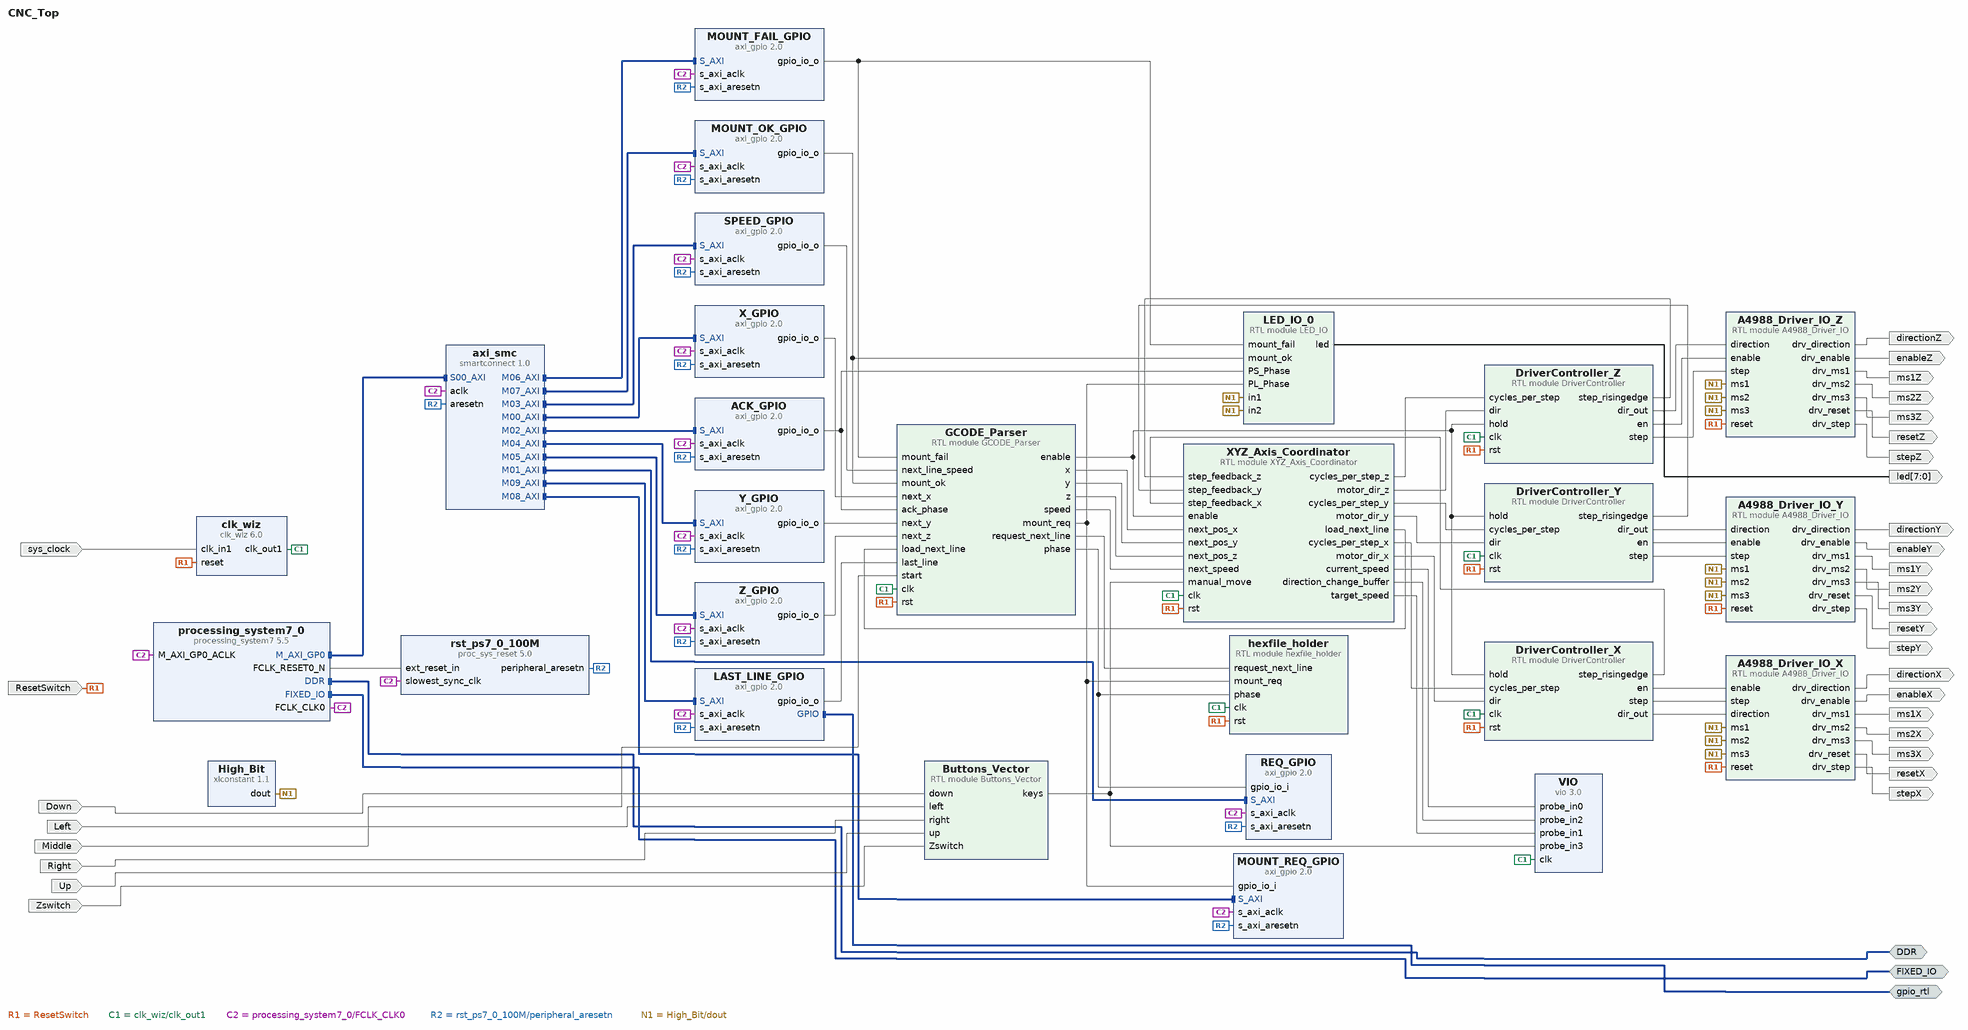
[diagram p0: block diagram of the top level]
# Vivado block design CNC_Top, xc7z020clg484-1, Vivado 2024.2
create_bd_design CNC_Top

create_bd_intf_port -mode Master -vlnv xilinx.com:interface:ddrx_rtl:1.0 DDR
create_bd_intf_port -mode Master -vlnv xilinx.com:display_processing_system7:fixedio_rtl:1.0 FIXED_IO
create_bd_intf_port -mode Master -vlnv xilinx.com:interface:gpio_rtl:1.0 gpio_rtl
create_bd_port -dir I -type clk sys_clock
set_property -dict {CONFIG.FREQ_HZ 100000000 CONFIG.PHASE 0.0} [get_bd_ports sys_clock]
create_bd_port -dir O directionX
create_bd_port -dir O stepX
create_bd_port -dir O -type rst resetX
create_bd_port -dir O ms1X
create_bd_port -dir O ms2X
create_bd_port -dir O ms3X
create_bd_port -dir O enableX
create_bd_port -dir O -from 7 -to 0 led
create_bd_port -dir O enableZ
create_bd_port -dir O directionZ
create_bd_port -dir O stepZ
create_bd_port -dir O resetZ
create_bd_port -dir O ms1Z
create_bd_port -dir O ms2Z
create_bd_port -dir O ms3Z
create_bd_port -dir O enableY
create_bd_port -dir O directionY
create_bd_port -dir O stepY
create_bd_port -dir O resetY
create_bd_port -dir O ms1Y
create_bd_port -dir O ms2Y
create_bd_port -dir O ms3Y
create_bd_port -dir I ResetSwitch
create_bd_port -dir I Middle
create_bd_port -dir I Left
create_bd_port -dir I Right
create_bd_port -dir I Up
create_bd_port -dir I Down
create_bd_port -dir I Zswitch

create_bd_cell -type ip -vlnv xilinx.com:ip:clk_wiz:6.0 clk_wiz
set_property -dict [list \
  CONFIG.CLKOUT1_REQUESTED_OUT_FREQ 100.0 \
  CONFIG.CLK_IN1_BOARD_INTERFACE sys_clock \
  CONFIG.USE_BOARD_FLOW true \
  CONFIG.USE_LOCKED false \
] [get_bd_cells clk_wiz]
create_bd_cell -type ip -vlnv xilinx.com:ip:xlconstant:1.1 High_Bit
set_property -dict {CONFIG.CONST_VAL 1 CONFIG.CONST_WIDTH 1} [get_bd_cells High_Bit]
create_bd_cell -type module -reference A4988_Driver_IO A4988_Driver_IO_X
create_bd_cell -type module -reference DriverController DriverController_X
create_bd_cell -type module -reference LED_IO LED_IO_0
create_bd_cell -type module -reference XYZ_Axis_Coordinator XYZ_Axis_Coordinator
create_bd_cell -type module -reference GCODE_Parser GCODE_Parser
create_bd_cell -type module -reference DriverController DriverController_Y
create_bd_cell -type module -reference DriverController DriverController_Z
create_bd_cell -type module -reference A4988_Driver_IO A4988_Driver_IO_Y
create_bd_cell -type module -reference A4988_Driver_IO A4988_Driver_IO_Z
create_bd_cell -type ip -vlnv xilinx.com:ip:vio:3.0 VIO
set_property -dict [list \
  CONFIG.C_NUM_PROBE_IN 4 \
  CONFIG.C_NUM_PROBE_OUT 0 \
  CONFIG.C_PROBE_IN0_WIDTH 8 \
  CONFIG.C_PROBE_IN1_WIDTH 8 \
  CONFIG.C_PROBE_IN2_WIDTH 32 \
  CONFIG.C_PROBE_IN3_WIDTH 5 \
] [get_bd_cells VIO]
create_bd_cell -type module -reference Buttons_Vector Buttons_Vector
create_bd_cell -type module -reference hexfile_holder hexfile_holder
create_bd_cell -type ip -vlnv xilinx.com:ip:processing_system7:5.5 processing_system7_0
set_property -dict [list \
  CONFIG.PCW_APU_PERIPHERAL_FREQMHZ 666.666667 \
  CONFIG.PCW_ENET0_PERIPHERAL_ENABLE 0 \
  CONFIG.PCW_FPGA0_PERIPHERAL_FREQMHZ 100.000000 \
  CONFIG.PCW_FPGA1_PERIPHERAL_FREQMHZ 150.000000 \
  CONFIG.PCW_FPGA2_PERIPHERAL_FREQMHZ 50.000000 \
  CONFIG.PCW_GPIO_MIO_GPIO_ENABLE 0 \
  CONFIG.PCW_PERIPHERAL_BOARD_PRESET part0 \
  CONFIG.PCW_PRESET_BANK1_VOLTAGE {LVCMOS 1.8V} \
  CONFIG.PCW_QSPI_PERIPHERAL_ENABLE 0 \
  CONFIG.PCW_SD0_GRP_CD_ENABLE 1 \
  CONFIG.PCW_SD0_GRP_CD_IO {MIO 47} \
  CONFIG.PCW_SD0_GRP_WP_ENABLE 1 \
  CONFIG.PCW_SD0_GRP_WP_IO {MIO 46} \
  CONFIG.PCW_SD0_PERIPHERAL_ENABLE 1 \
  CONFIG.PCW_SD0_SD0_IO {MIO 40 .. 45} \
  CONFIG.PCW_SDIO_PERIPHERAL_FREQMHZ 50 \
  CONFIG.PCW_UART1_PERIPHERAL_ENABLE 1 \
  CONFIG.PCW_UART1_UART1_IO {MIO 48 .. 49} \
  CONFIG.PCW_UART_PERIPHERAL_FREQMHZ 50 \
  CONFIG.PCW_UIPARAM_DDR_FREQ_MHZ 533.333313 \
  CONFIG.PCW_UIPARAM_DDR_PARTNO {MT41J128M16 HA-15E} \
  CONFIG.PCW_USB0_PERIPHERAL_ENABLE 0 \
  CONFIG.preset ZedBoard \
] [get_bd_cells processing_system7_0]
# 94 more settings of processing_system7_0 are not shown: defaults, MIO pin electricals, DDR timing, and values the tool derives
create_bd_cell -type ip -vlnv xilinx.com:ip:axi_gpio:2.0 X_GPIO
set_property -dict [list \
  CONFIG.C_ALL_INPUTS 0 \
  CONFIG.C_ALL_OUTPUTS 1 \
  CONFIG.C_GPIO_WIDTH 32 \
  CONFIG.GPIO_BOARD_INTERFACE Custom \
  CONFIG.USE_BOARD_FLOW true \
] [get_bd_cells X_GPIO]
create_bd_cell -type ip -vlnv xilinx.com:ip:smartconnect:1.0 axi_smc
set_property -dict {CONFIG.NUM_MI 10 CONFIG.NUM_SI 1} [get_bd_cells axi_smc]
create_bd_cell -type ip -vlnv xilinx.com:ip:proc_sys_reset:5.0 rst_ps7_0_100M
create_bd_cell -type ip -vlnv xilinx.com:ip:axi_gpio:2.0 Y_GPIO
set_property -dict [list \
  CONFIG.C_ALL_INPUTS 0 \
  CONFIG.C_ALL_OUTPUTS 1 \
  CONFIG.C_GPIO_WIDTH 32 \
  CONFIG.GPIO_BOARD_INTERFACE Custom \
  CONFIG.USE_BOARD_FLOW true \
] [get_bd_cells Y_GPIO]
create_bd_cell -type ip -vlnv xilinx.com:ip:axi_gpio:2.0 Z_GPIO
set_property -dict [list \
  CONFIG.C_ALL_INPUTS 0 \
  CONFIG.C_ALL_OUTPUTS 1 \
  CONFIG.C_GPIO_WIDTH 32 \
  CONFIG.GPIO_BOARD_INTERFACE Custom \
  CONFIG.USE_BOARD_FLOW true \
] [get_bd_cells Z_GPIO]
create_bd_cell -type ip -vlnv xilinx.com:ip:axi_gpio:2.0 SPEED_GPIO
set_property -dict [list \
  CONFIG.C_ALL_INPUTS 0 \
  CONFIG.C_ALL_OUTPUTS 1 \
  CONFIG.C_GPIO_WIDTH 8 \
  CONFIG.GPIO_BOARD_INTERFACE Custom \
  CONFIG.USE_BOARD_FLOW true \
] [get_bd_cells SPEED_GPIO]
create_bd_cell -type ip -vlnv xilinx.com:ip:axi_gpio:2.0 ACK_GPIO
set_property -dict [list \
  CONFIG.C_ALL_INPUTS 0 \
  CONFIG.C_ALL_OUTPUTS 1 \
  CONFIG.C_GPIO_WIDTH 2 \
  CONFIG.GPIO_BOARD_INTERFACE Custom \
  CONFIG.USE_BOARD_FLOW true \
] [get_bd_cells ACK_GPIO]
create_bd_cell -type ip -vlnv xilinx.com:ip:axi_gpio:2.0 REQ_GPIO
set_property -dict [list \
  CONFIG.C_ALL_INPUTS 1 \
  CONFIG.C_GPIO_WIDTH 2 \
  CONFIG.GPIO_BOARD_INTERFACE Custom \
  CONFIG.USE_BOARD_FLOW true \
] [get_bd_cells REQ_GPIO]
create_bd_cell -type ip -vlnv xilinx.com:ip:axi_gpio:2.0 MOUNT_OK_GPIO
set_property -dict [list \
  CONFIG.C_ALL_OUTPUTS 1 \
  CONFIG.C_GPIO_WIDTH 1 \
  CONFIG.GPIO_BOARD_INTERFACE Custom \
  CONFIG.USE_BOARD_FLOW true \
] [get_bd_cells MOUNT_OK_GPIO]
create_bd_cell -type ip -vlnv xilinx.com:ip:axi_gpio:2.0 MOUNT_FAIL_GPIO
set_property -dict [list \
  CONFIG.C_ALL_OUTPUTS 1 \
  CONFIG.C_GPIO_WIDTH 1 \
  CONFIG.GPIO_BOARD_INTERFACE Custom \
  CONFIG.USE_BOARD_FLOW true \
] [get_bd_cells MOUNT_FAIL_GPIO]
create_bd_cell -type ip -vlnv xilinx.com:ip:axi_gpio:2.0 MOUNT_REQ_GPIO
set_property -dict {CONFIG.C_ALL_INPUTS 1 CONFIG.C_GPIO_WIDTH 1} [get_bd_cells MOUNT_REQ_GPIO]
create_bd_cell -type ip -vlnv xilinx.com:ip:axi_gpio:2.0 LAST_LINE_GPIO
set_property -dict [list \
  CONFIG.C_ALL_OUTPUTS 1 \
  CONFIG.C_GPIO_WIDTH 1 \
  CONFIG.GPIO_BOARD_INTERFACE Custom \
  CONFIG.USE_BOARD_FLOW true \
] [get_bd_cells LAST_LINE_GPIO]

# ---- connections ----

connect_bd_intf_net [get_bd_intf_ports gpio_rtl] [get_bd_intf_pins LAST_LINE_GPIO/GPIO]
connect_bd_intf_net [get_bd_intf_pins axi_smc/M00_AXI] [get_bd_intf_pins X_GPIO/S_AXI]
connect_bd_intf_net [get_bd_intf_pins axi_smc/M01_AXI] [get_bd_intf_pins REQ_GPIO/S_AXI]
connect_bd_intf_net [get_bd_intf_pins axi_smc/M02_AXI] [get_bd_intf_pins ACK_GPIO/S_AXI]
connect_bd_intf_net [get_bd_intf_pins axi_smc/M03_AXI] [get_bd_intf_pins SPEED_GPIO/S_AXI]
connect_bd_intf_net [get_bd_intf_pins axi_smc/M04_AXI] [get_bd_intf_pins Y_GPIO/S_AXI]
connect_bd_intf_net [get_bd_intf_pins axi_smc/M05_AXI] [get_bd_intf_pins Z_GPIO/S_AXI]
connect_bd_intf_net [get_bd_intf_pins axi_smc/M06_AXI] [get_bd_intf_pins MOUNT_FAIL_GPIO/S_AXI]
connect_bd_intf_net [get_bd_intf_pins axi_smc/M07_AXI] [get_bd_intf_pins MOUNT_OK_GPIO/S_AXI]
connect_bd_intf_net [get_bd_intf_pins axi_smc/M08_AXI] [get_bd_intf_pins MOUNT_REQ_GPIO/S_AXI]
connect_bd_intf_net [get_bd_intf_pins axi_smc/M09_AXI] [get_bd_intf_pins LAST_LINE_GPIO/S_AXI]
connect_bd_intf_net [get_bd_intf_ports DDR] [get_bd_intf_pins processing_system7_0/DDR]
connect_bd_intf_net [get_bd_intf_ports FIXED_IO] [get_bd_intf_pins processing_system7_0/FIXED_IO]
connect_bd_intf_net [get_bd_intf_pins processing_system7_0/M_AXI_GP0] [get_bd_intf_pins axi_smc/S00_AXI]
connect_bd_net -net A4988_Driver_IO1_drv_direction [get_bd_pins A4988_Driver_IO_Y/drv_direction] [get_bd_ports directionY]
connect_bd_net -net A4988_Driver_IO1_drv_enable [get_bd_pins A4988_Driver_IO_Y/drv_enable] [get_bd_ports enableY]
connect_bd_net -net A4988_Driver_IO1_drv_ms1 [get_bd_pins A4988_Driver_IO_Y/drv_ms1] [get_bd_ports ms1Y]
connect_bd_net -net A4988_Driver_IO1_drv_ms2 [get_bd_pins A4988_Driver_IO_Y/drv_ms2] [get_bd_ports ms2Y]
connect_bd_net -net A4988_Driver_IO1_drv_ms3 [get_bd_pins A4988_Driver_IO_Y/drv_ms3] [get_bd_ports ms3Y]
connect_bd_net -net A4988_Driver_IO1_drv_reset [get_bd_pins A4988_Driver_IO_Y/drv_reset] [get_bd_ports resetY]
connect_bd_net -net A4988_Driver_IO1_drv_step [get_bd_pins A4988_Driver_IO_Y/drv_step] [get_bd_ports stepY]
connect_bd_net -net A4988_Driver_IO2_drv_direction [get_bd_pins A4988_Driver_IO_Z/drv_direction] [get_bd_ports directionZ]
connect_bd_net -net A4988_Driver_IO2_drv_enable [get_bd_pins A4988_Driver_IO_Z/drv_enable] [get_bd_ports enableZ]
connect_bd_net -net A4988_Driver_IO2_drv_ms1 [get_bd_pins A4988_Driver_IO_Z/drv_ms1] [get_bd_ports ms1Z]
connect_bd_net -net A4988_Driver_IO2_drv_ms2 [get_bd_pins A4988_Driver_IO_Z/drv_ms2] [get_bd_ports ms2Z]
connect_bd_net -net A4988_Driver_IO2_drv_ms3 [get_bd_pins A4988_Driver_IO_Z/drv_ms3] [get_bd_ports ms3Z]
connect_bd_net -net A4988_Driver_IO2_drv_reset [get_bd_pins A4988_Driver_IO_Z/drv_reset] [get_bd_ports resetZ]
connect_bd_net -net A4988_Driver_IO2_drv_step [get_bd_pins A4988_Driver_IO_Z/drv_step] [get_bd_ports stepZ]
connect_bd_net -net A4988_Driver_IO_drv_direction [get_bd_pins A4988_Driver_IO_X/drv_direction] [get_bd_ports directionX]
connect_bd_net -net A4988_Driver_IO_drv_enable [get_bd_pins A4988_Driver_IO_X/drv_enable] [get_bd_ports enableX]
connect_bd_net -net A4988_Driver_IO_drv_ms1 [get_bd_pins A4988_Driver_IO_X/drv_ms1] [get_bd_ports ms1X]
connect_bd_net -net A4988_Driver_IO_drv_ms2 [get_bd_pins A4988_Driver_IO_X/drv_ms2] [get_bd_ports ms2X]
connect_bd_net -net A4988_Driver_IO_drv_ms3 [get_bd_pins A4988_Driver_IO_X/drv_ms3] [get_bd_ports ms3X]
connect_bd_net -net A4988_Driver_IO_drv_reset [get_bd_pins A4988_Driver_IO_X/drv_reset] [get_bd_ports resetX]
connect_bd_net -net A4988_Driver_IO_drv_step [get_bd_pins A4988_Driver_IO_X/drv_step] [get_bd_ports stepX]
connect_bd_net [get_bd_pins ACK_GPIO/gpio_io_o] [get_bd_pins LED_IO_0/PS_Phase] [get_bd_pins GCODE_Parser/ack_phase]
connect_bd_net -net Buttons_Vector_0_keys [get_bd_pins Buttons_Vector/keys] [get_bd_pins VIO/probe_in3] [get_bd_pins XYZ_Axis_Coordinator/manual_move]
connect_bd_net [get_bd_ports Down] [get_bd_pins Buttons_Vector/down]
connect_bd_net -net DriverController_0_en [get_bd_pins DriverController_X/en] [get_bd_pins A4988_Driver_IO_X/enable]
connect_bd_net -net DriverController_0_step [get_bd_pins DriverController_X/step] [get_bd_pins A4988_Driver_IO_X/step]
connect_bd_net -net DriverController_X1_step_risingedge [get_bd_pins DriverController_Y/step_risingedge] \
  [get_bd_pins XYZ_Axis_Coordinator/step_feedback_y]
connect_bd_net -net DriverController_X2_step_risingedge [get_bd_pins DriverController_Z/step_risingedge] \
  [get_bd_pins XYZ_Axis_Coordinator/step_feedback_z]
connect_bd_net [get_bd_pins DriverController_X/dir_out] [get_bd_pins A4988_Driver_IO_X/direction]
connect_bd_net [get_bd_pins DriverController_X/step_risingedge] [get_bd_pins XYZ_Axis_Coordinator/step_feedback_x]
connect_bd_net [get_bd_pins DriverController_Y/dir_out] [get_bd_pins A4988_Driver_IO_Y/direction]
connect_bd_net [get_bd_pins DriverController_Y/en] [get_bd_pins A4988_Driver_IO_Y/enable]
connect_bd_net [get_bd_pins DriverController_Y/step] [get_bd_pins A4988_Driver_IO_Y/step]
connect_bd_net [get_bd_pins DriverController_Z/dir_out] [get_bd_pins A4988_Driver_IO_Z/direction]
connect_bd_net [get_bd_pins DriverController_Z/en] [get_bd_pins A4988_Driver_IO_Z/enable]
connect_bd_net [get_bd_pins DriverController_Z/step] [get_bd_pins A4988_Driver_IO_Z/step]
connect_bd_net -net GCODE_Parser_0_enable [get_bd_pins GCODE_Parser/enable] \
  [get_bd_pins DriverController_X/hold] [get_bd_pins DriverController_Y/hold] [get_bd_pins DriverController_Z/hold] \
  [get_bd_pins XYZ_Axis_Coordinator/enable]
connect_bd_net -net GCODE_Parser_0_mount_req [get_bd_pins GCODE_Parser/mount_req] \
  [get_bd_pins hexfile_holder/mount_req] [get_bd_pins LED_IO_0/PL_Phase] [get_bd_pins MOUNT_REQ_GPIO/gpio_io_i]
connect_bd_net -net GCODE_Parser_0_next_pos_x [get_bd_pins GCODE_Parser/x] [get_bd_pins XYZ_Axis_Coordinator/next_pos_x]
connect_bd_net -net GCODE_Parser_0_next_pos_y [get_bd_pins GCODE_Parser/y] [get_bd_pins XYZ_Axis_Coordinator/next_pos_y]
connect_bd_net -net GCODE_Parser_0_next_pos_z [get_bd_pins GCODE_Parser/z] [get_bd_pins XYZ_Axis_Coordinator/next_pos_z]
connect_bd_net -net GCODE_Parser_0_phase [get_bd_pins GCODE_Parser/phase] [get_bd_pins hexfile_holder/phase] [get_bd_pins REQ_GPIO/gpio_io_i]
connect_bd_net -net GCODE_Parser_0_request_next_line [get_bd_pins GCODE_Parser/request_next_line] [get_bd_pins hexfile_holder/request_next_line]
connect_bd_net -net GCODE_Parser_0_speed [get_bd_pins GCODE_Parser/speed] [get_bd_pins XYZ_Axis_Coordinator/next_speed]
connect_bd_net [get_bd_pins LAST_LINE_GPIO/gpio_io_o] [get_bd_pins GCODE_Parser/last_line]
connect_bd_net [get_bd_pins LED_IO_0/led] [get_bd_ports led]
connect_bd_net [get_bd_ports Left] [get_bd_pins Buttons_Vector/left]
connect_bd_net [get_bd_pins MOUNT_FAIL_GPIO/gpio_io_o] [get_bd_pins LED_IO_0/mount_fail] [get_bd_pins GCODE_Parser/mount_fail]
connect_bd_net [get_bd_pins MOUNT_OK_GPIO/gpio_io_o] [get_bd_pins LED_IO_0/mount_ok] [get_bd_pins GCODE_Parser/mount_ok]
connect_bd_net [get_bd_ports Middle] [get_bd_pins GCODE_Parser/start]
connect_bd_net [get_bd_ports ResetSwitch] \
  [get_bd_pins A4988_Driver_IO_X/reset] [get_bd_pins A4988_Driver_IO_Z/reset] [get_bd_pins A4988_Driver_IO_Y/reset] \
  [get_bd_pins hexfile_holder/rst] [get_bd_pins GCODE_Parser/rst] [get_bd_pins DriverController_X/rst] \
  [get_bd_pins DriverController_Y/rst] [get_bd_pins DriverController_Z/rst] [get_bd_pins clk_wiz/reset] \
  [get_bd_pins XYZ_Axis_Coordinator/rst]
connect_bd_net [get_bd_ports Right] [get_bd_pins Buttons_Vector/right]
connect_bd_net [get_bd_pins SPEED_GPIO/gpio_io_o] [get_bd_pins GCODE_Parser/next_line_speed]
connect_bd_net [get_bd_ports Up] [get_bd_pins Buttons_Vector/up]
connect_bd_net -net XYZ_Axis_Coordinator_0_current_speed [get_bd_pins XYZ_Axis_Coordinator/current_speed] [get_bd_pins VIO/probe_in0]
connect_bd_net -net XYZ_Axis_Coordinator_0_cycles_per_step_x [get_bd_pins XYZ_Axis_Coordinator/cycles_per_step_x] \
  [get_bd_pins DriverController_X/cycles_per_step]
connect_bd_net -net XYZ_Axis_Coordinator_0_cycles_per_step_y [get_bd_pins XYZ_Axis_Coordinator/cycles_per_step_y] \
  [get_bd_pins DriverController_Y/cycles_per_step]
connect_bd_net -net XYZ_Axis_Coordinator_0_cycles_per_step_z [get_bd_pins XYZ_Axis_Coordinator/cycles_per_step_z] \
  [get_bd_pins DriverController_Z/cycles_per_step]
connect_bd_net -net XYZ_Axis_Coordinator_0_dir_x [get_bd_pins XYZ_Axis_Coordinator/motor_dir_x] [get_bd_pins DriverController_X/dir]
connect_bd_net -net XYZ_Axis_Coordinator_0_dir_y [get_bd_pins XYZ_Axis_Coordinator/motor_dir_y] [get_bd_pins DriverController_Y/dir]
connect_bd_net -net XYZ_Axis_Coordinator_0_dir_z [get_bd_pins XYZ_Axis_Coordinator/motor_dir_z] [get_bd_pins DriverController_Z/dir]
connect_bd_net -net XYZ_Axis_Coordinator_0_direction_change_buffer [get_bd_pins XYZ_Axis_Coordinator/direction_change_buffer] \
  [get_bd_pins VIO/probe_in2]
connect_bd_net -net XYZ_Axis_Coordinator_0_load_next_line [get_bd_pins XYZ_Axis_Coordinator/load_next_line] [get_bd_pins GCODE_Parser/load_next_line]
connect_bd_net -net XYZ_Axis_Coordinator_0_target_speed [get_bd_pins XYZ_Axis_Coordinator/target_speed] [get_bd_pins VIO/probe_in1]
connect_bd_net [get_bd_pins X_GPIO/gpio_io_o] [get_bd_pins GCODE_Parser/next_x]
connect_bd_net [get_bd_pins Y_GPIO/gpio_io_o] [get_bd_pins GCODE_Parser/next_y]
connect_bd_net [get_bd_pins Z_GPIO/gpio_io_o] [get_bd_pins GCODE_Parser/next_z]
connect_bd_net [get_bd_ports Zswitch] [get_bd_pins Buttons_Vector/Zswitch]
connect_bd_net [get_bd_pins clk_wiz/clk_out1] \
  [get_bd_pins VIO/clk] [get_bd_pins hexfile_holder/clk] [get_bd_pins GCODE_Parser/clk] [get_bd_pins DriverController_X/clk] \
  [get_bd_pins DriverController_Y/clk] [get_bd_pins DriverController_Z/clk] [get_bd_pins XYZ_Axis_Coordinator/clk]
connect_bd_net [get_bd_pins processing_system7_0/FCLK_CLK0] \
  [get_bd_pins X_GPIO/s_axi_aclk] [get_bd_pins Y_GPIO/s_axi_aclk] [get_bd_pins Z_GPIO/s_axi_aclk] \
  [get_bd_pins SPEED_GPIO/s_axi_aclk] [get_bd_pins ACK_GPIO/s_axi_aclk] [get_bd_pins REQ_GPIO/s_axi_aclk] \
  [get_bd_pins MOUNT_OK_GPIO/s_axi_aclk] [get_bd_pins MOUNT_FAIL_GPIO/s_axi_aclk] [get_bd_pins MOUNT_REQ_GPIO/s_axi_aclk] \
  [get_bd_pins LAST_LINE_GPIO/s_axi_aclk] [get_bd_pins axi_smc/aclk] [get_bd_pins processing_system7_0/M_AXI_GP0_ACLK] \
  [get_bd_pins rst_ps7_0_100M/slowest_sync_clk]
connect_bd_net [get_bd_pins processing_system7_0/FCLK_RESET0_N] [get_bd_pins rst_ps7_0_100M/ext_reset_in]
connect_bd_net [get_bd_pins rst_ps7_0_100M/peripheral_aresetn] \
  [get_bd_pins X_GPIO/s_axi_aresetn] [get_bd_pins Y_GPIO/s_axi_aresetn] [get_bd_pins Z_GPIO/s_axi_aresetn] \
  [get_bd_pins SPEED_GPIO/s_axi_aresetn] [get_bd_pins ACK_GPIO/s_axi_aresetn] [get_bd_pins REQ_GPIO/s_axi_aresetn] \
  [get_bd_pins MOUNT_OK_GPIO/s_axi_aresetn] [get_bd_pins MOUNT_FAIL_GPIO/s_axi_aresetn] \
  [get_bd_pins MOUNT_REQ_GPIO/s_axi_aresetn] [get_bd_pins LAST_LINE_GPIO/s_axi_aresetn] [get_bd_pins axi_smc/aresetn]
connect_bd_net [get_bd_ports sys_clock] [get_bd_pins clk_wiz/clk_in1]
connect_bd_net -net xlconstant_1_dout [get_bd_pins High_Bit/dout] \
  [get_bd_pins A4988_Driver_IO_X/ms1] [get_bd_pins A4988_Driver_IO_X/ms2] [get_bd_pins A4988_Driver_IO_Z/ms1] \
  [get_bd_pins A4988_Driver_IO_Z/ms2] [get_bd_pins A4988_Driver_IO_Y/ms1] [get_bd_pins A4988_Driver_IO_Y/ms2] \
  [get_bd_pins A4988_Driver_IO_Y/ms3] [get_bd_pins A4988_Driver_IO_Z/ms3] [get_bd_pins A4988_Driver_IO_X/ms3] \
  [get_bd_pins LED_IO_0/in1] [get_bd_pins LED_IO_0/in2]

# ---- address map ----
assign_bd_address -offset 0x41200000 -range 64K -target_address_space [get_bd_addr_spaces processing_system7_0/Data] [get_bd_addr_segs X_GPIO/S_AXI/Reg]
assign_bd_address -offset 0x41210000 -range 64K -target_address_space [get_bd_addr_spaces processing_system7_0/Data] [get_bd_addr_segs REQ_GPIO/S_AXI/Reg]
assign_bd_address -offset 0x41220000 -range 64K -target_address_space [get_bd_addr_spaces processing_system7_0/Data] [get_bd_addr_segs ACK_GPIO/S_AXI/Reg]
assign_bd_address -offset 0x41230000 -range 64K -target_address_space [get_bd_addr_spaces processing_system7_0/Data] [get_bd_addr_segs SPEED_GPIO/S_AXI/Reg]
assign_bd_address -offset 0x41240000 -range 64K -target_address_space [get_bd_addr_spaces processing_system7_0/Data] [get_bd_addr_segs Y_GPIO/S_AXI/Reg]
assign_bd_address -offset 0x41250000 -range 64K -target_address_space [get_bd_addr_spaces processing_system7_0/Data] [get_bd_addr_segs Z_GPIO/S_AXI/Reg]
assign_bd_address -offset 0x41260000 -range 64K -target_address_space [get_bd_addr_spaces processing_system7_0/Data] [get_bd_addr_segs MOUNT_FAIL_GPIO/S_AXI/Reg]
assign_bd_address -offset 0x41270000 -range 64K -target_address_space [get_bd_addr_spaces processing_system7_0/Data] [get_bd_addr_segs MOUNT_OK_GPIO/S_AXI/Reg]
assign_bd_address -offset 0x41280000 -range 64K -target_address_space [get_bd_addr_spaces processing_system7_0/Data] [get_bd_addr_segs MOUNT_REQ_GPIO/S_AXI/Reg]
assign_bd_address -offset 0x41290000 -range 64K -target_address_space [get_bd_addr_spaces processing_system7_0/Data] [get_bd_addr_segs LAST_LINE_GPIO/S_AXI/Reg]

validate_bd_design
save_bd_design
